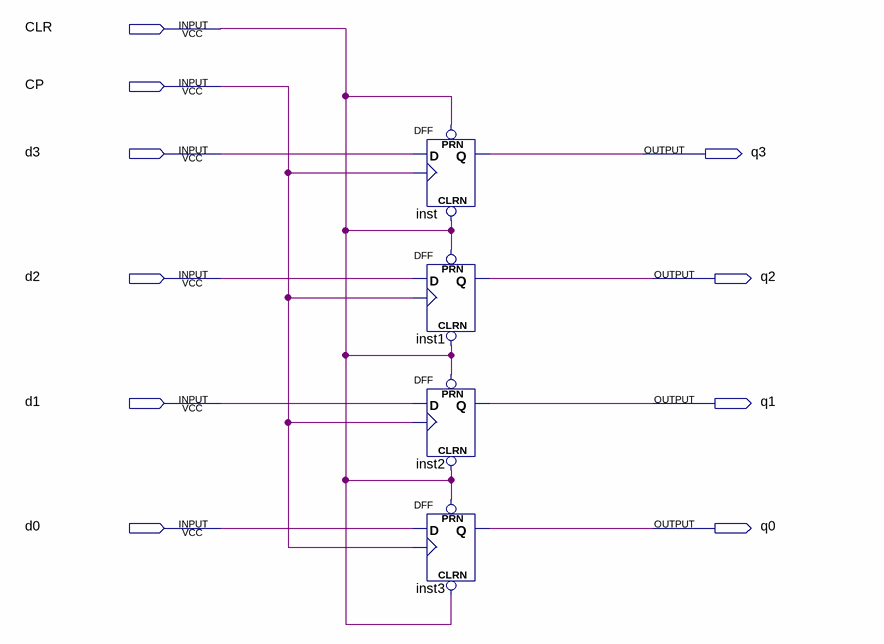
[diagram p0: schematic sheet]
// Quartus schematic register-4.bdf as structural Verilog: 4 symbols, 10 pins
module \register-4  (
  input  CLR,
  input  CP,
  input  d3,
  input  d2,
  input  d1,
  input  d0,
  output q3,
  output q2,
  output q1,
  output q0
);

  DFF inst (.CLRN(CLR), .CLK(CP), .D(d3), .PRN(CLR), .Q(q3));
  DFF inst1 (.CLRN(CLR), .CLK(CP), .D(d2), .PRN(CLR), .Q(q2));
  DFF inst2 (.CLRN(CLR), .CLK(CP), .D(d1), .PRN(CLR), .Q(q1));
  DFF inst3 (.CLRN(CLR), .CLK(CP), .D(d0), .PRN(CLR), .Q(q0));
endmodule
